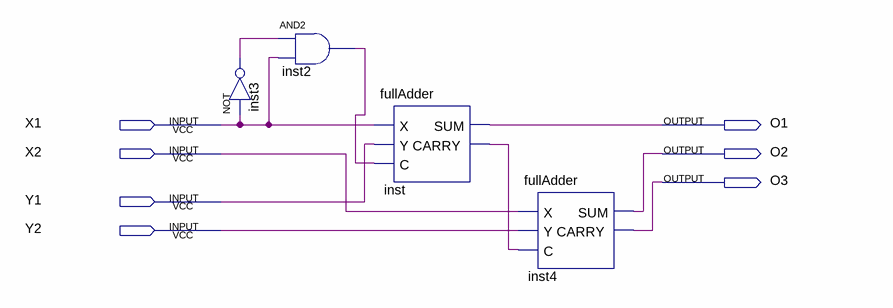
[diagram p0: schematic sheet]
// Quartus schematic 2bitAdder.bdf as structural Verilog: 4 symbols, 7 pins
module \2bitAdder  (
  input  X1,
  input  X2,
  input  Y1,
  input  Y2,
  output O1,
  output O2,
  output O3
);

  wire inst2_out, inst3_out, inst_carry;

  and inst2 (inst2_out, inst3_out, X1);
  not inst3 (inst3_out, X1);
  fullAdder inst (.X(X1), .Y(Y1), .C(inst2_out), .SUM(O1), .CARRY(inst_carry));
  fullAdder inst4 (.X(X2), .Y(Y2), .C(inst_carry), .SUM(O2), .CARRY(O3));
endmodule
